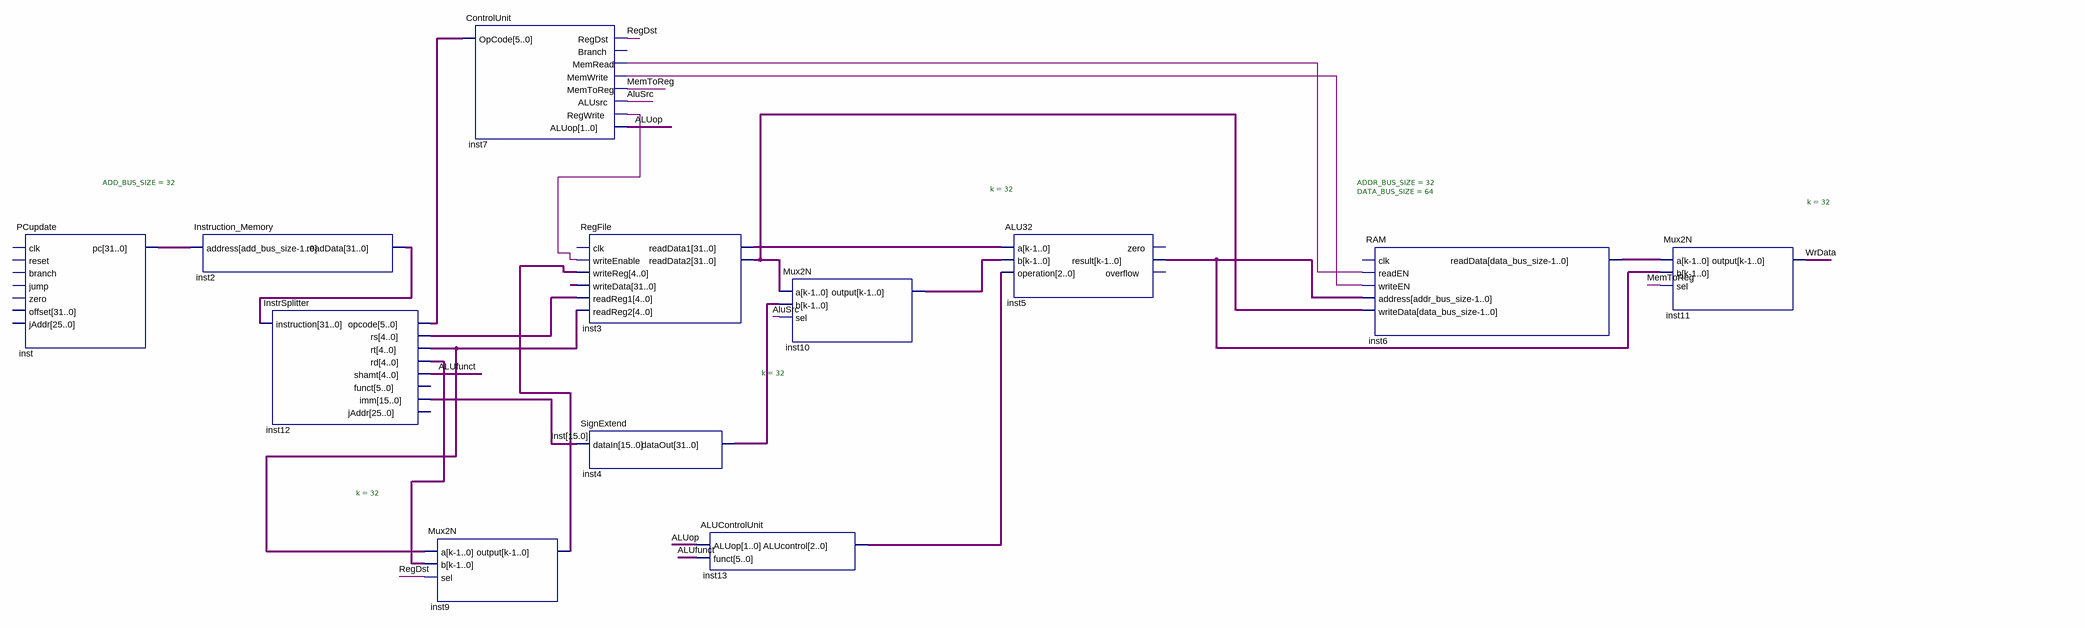
[diagram p0: schematic sheet]
// Quartus schematic cenas.bdf as structural Verilog: 12 symbols, 0 pins
module cenas (
);

  wire ALUfunct, ALUop, AluSrc, inst7_memread, inst7_memwrite, inst7_regwrite, \Inst[15.0] , MemToReg,
       RegDst, WrData;
  wire [2:0] inst13_alucontrol;
  wire [4:0] inst12_rs;
  wire [5:0] inst12_opcode;
  wire [31:0] inst2_readdata, inst3_readdata1, inst4_dataout, inst5_result, inst9_output, inst10_output,
       inst12_rd, inst12_rt, inst_pc, undriven;
  wire [63:0] inst3_readdata2, inst6_readdata;

  PCupdate inst (.pc(inst_pc));  // open: clk, reset, branch, jump, zero, offset, jAddr
  Instruction_Memory #(.ADD_BUS_SIZE(32)) inst2 (.address(inst_pc), .readData(inst2_readdata));
  InstrSplitter inst12 (
    .instruction(inst2_readdata), .opcode(inst12_opcode), .rs(inst12_rs), .rt(inst12_rt), .rd(inst12_rd),
    .shamt(ALUfunct), .imm(\Inst[15.0] ));  // open: funct, jAddr
  ControlUnit inst7 (
    .OpCode(inst12_opcode), .RegDst(RegDst), .MemRead(inst7_memread), .MemWrite(inst7_memwrite),
    .MemToReg(MemToReg), .ALUsrc(AluSrc), .RegWrite(inst7_regwrite), .ALUop(ALUop));  // open: Branch
  Mux2N #(.k(32)) inst9 (.a(inst12_rt), .b(inst12_rd), .sel(RegDst), .\output (inst9_output));
  RegFile inst3 (
    .writeEnable(inst7_regwrite), .writeReg(inst9_output), .writeData(undriven), .readReg1(inst12_rs),
    .readReg2(inst12_rt), .readData1(inst3_readdata1), .readData2(inst3_readdata2));  // open: clk
  SignExtend inst4 (.dataIn({16{\Inst[15.0] }}), .dataOut(inst4_dataout));
  ALUControlUnit inst13 (.ALUop({2{ALUop}}), .funct({6{ALUfunct}}), .ALUcontrol(inst13_alucontrol));
  Mux2N #(.k(32)) inst10 (.a(inst3_readdata2), .b(inst4_dataout), .sel(AluSrc), .\output (inst10_output));
  ALU32 #(.k(32)) inst5 (
    .a(inst3_readdata1), .b(inst10_output), .operation(inst13_alucontrol), .result(inst5_result));  // open: zero, overflow
  RAM #(.ADDR_BUS_SIZE(32), .DATA_BUS_SIZE(64)) inst6 (
    .readEN(inst7_memread), .writeEN(inst7_memwrite), .address(inst5_result), .writeData(inst3_readdata2),
    .readData(inst6_readdata));  // open: clk
  Mux2N #(.k(32)) inst11 (.a(inst6_readdata), .b(inst5_result), .sel(MemToReg), .\output (WrData));
endmodule
